# EAGLE schematic ArduinoBuzzerLed (EAGLE 9.4.2)
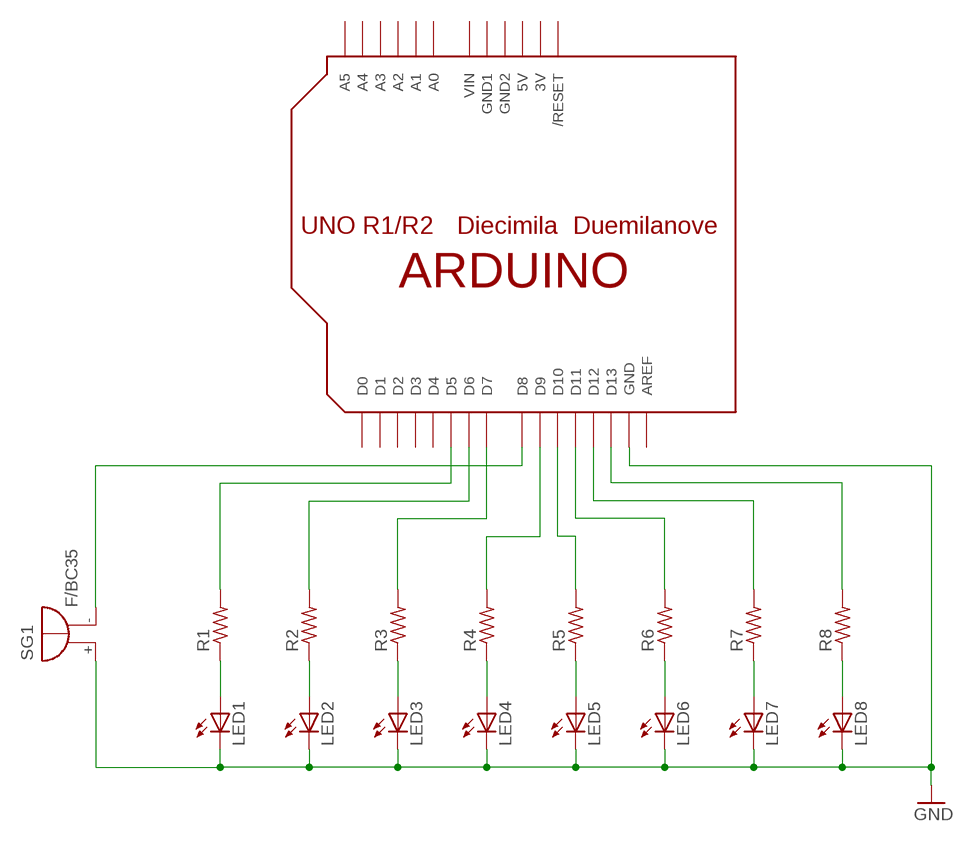
[diagram p0: schematic, sheet 1]

## Parts
LED1  LED5MM  [LED5MM]
LED2  LED5MM  [LED5MM]
LED3  LED5MM  [LED5MM]
LED4  LED5MM  [LED5MM]
LED5  LED5MM  [LED5MM]
LED6  LED5MM  [LED5MM]
LED7  LED5MM  [LED5MM]
LED8  LED5MM  [LED5MM]
R1  R-US_0204/7  [0204/7]
R2  R-US_0204/7  [0204/7]
R3  R-US_0204/7  [0204/7]
R4  R-US_0204/7  [0204/7]
R5  R-US_0204/7  [0204/7]
R6  R-US_0204/7  [0204/7]
R7  R-US_0204/7  [0204/7]
R8  R-US_0204/7  [0204/7]
SG1  F/BC35  [F/BC35]
U$2  ARDUINOUNO  [ARDUINO]

## Nets
GND: LED1.K(C) LED2.K(C) LED3.K(C) LED4.K(C) LED5.K(C) LED6.K(C) LED7.K(C) LED8.K(C) SG1.+ U$2.GND
N$1: LED1.A R1.1
N$2: LED2.A R2.1
N$3: LED3.A R3.1
N$4: LED4.A R4.1
N$5: LED5.A R5.1
N$6: LED6.A R6.1
N$7: LED7.A R7.1
N$8: LED8.A R8.1
N$9: R8.2 U$2.D13
N$10: R7.2 U$2.D12
N$11: R6.2 U$2.D11
N$12: R5.2 U$2.D10
N$13: R4.2 U$2.D9
N$14: R3.2 U$2.D7
N$15: R2.2 U$2.D6
N$16: R1.2 U$2.D5
N$18: SG1.- U$2.D8
Unconnected: U$2.A0 U$2.A1 U$2.A2 U$2.A3 U$2.A4 U$2.A5 U$2.AREF U$2.D0 U$2.D1 U$2.D2 U$2.D3 U$2.D4 U$2.RESET(/RESET)

## Power pins joined to a net without a drawn wire
3V: U$2.3V
5V: U$2.5V
GND1: U$2.GND1
GND2: U$2.GND2
VIN: U$2.VIN

## Library data of the parts
LED1-LED8 = adafruit:LED: LED OSRAM: - CHIPLED LG R971, LG N971, LY N971, LG Q971, LY Q971, LO R971, LY R971 LH N974, LH R974 LS Q976, LO Q976, LY Q976 LO Q996 - Hyper CHIPLED LW Q18S LB Q993, LB Q99A, LB R99A - SideLED LS A670, LO A670, LY A670, LG A670, LP A670 LB A673, LV A673, LT A673, LW A673 LH A674 LY A675 LS A676, LA A676, LO A676, LY A676, LW A676 LS A679, LY A679, LG A679 - Hyper Micro SIDELED® LS Y876, LA Y876, LO Y876, LY Y876 LT Y87S - SmartLED LW L88C, LW L88S LB L89C, LB L89S, LG L890 LS L89K, LO L89K, LY L89K LS L896, LA L896, LO L896, LY L896 - TOPLED LS T670, LO T670, LY T670, LG T670, LP T670 LSG T670, LSP T670, LSY T670, LOP T670, LYG T670 LG T671, LOG T671, LSG T671 LB T673, LV T673, LT T673, LW T673 LH T674 LS T676, LA T676, LO T676, LY T676, LB T676, LH T676, LSB T676, LW T676 LB T67C, LV T67C, LT T67C, LS T67K, LO T67K, LY T67K, LW E67C LS E67B, LA E67B, LO E67B, LY E67B, LB E67C, LV E67C, LT E67C LW T67C LS T679, LY T679, LG T679 LS T770, LO T770, LY T770, LG T770, LP T770 LB T773, LV T773, LT T773, LW T773 LH T774 LS E675, LA E675, LY E675, LS T675 LS T776, LA T776, LO T776, LY T776, LB T776 LHGB T686 LT T68C, LB T68C - Hyper Mini TOPLED® LB M676 - Mini TOPLED Santana® LG M470 LS M47K, LO M47K, LY M47K Source: http://www.osram.convergy.de/
R1-R8 = adafruit:R-US_: RESISTOR, American symbol
SG1 = buzzer:F/BC35: BUZZER Source: Spoerle; OC_FARNELL: unknown; OC_NEWARK: unknown
U$2 = adafruit:ARDUINO: Arduino Diecimila/Duemilanove Make a shield with ease, this package has all the named pins as well as the two mounting drill holes and an outline of the USB and DC power connector. The outline is on the DIMENSION layer, so if your board house uses it they will cut the outline to match. http://www.ladyada.net/library/pcb/eaglelibrary.html